# Altium schematic sheet [01] Cover_page.SchDoc: =GlobalProjectName
size A3; Engineer: M. Folejewski; DocumentNumber: 1; SheetNumber: 1; SheetTotal: 15; Designators: -; PageSize: A3
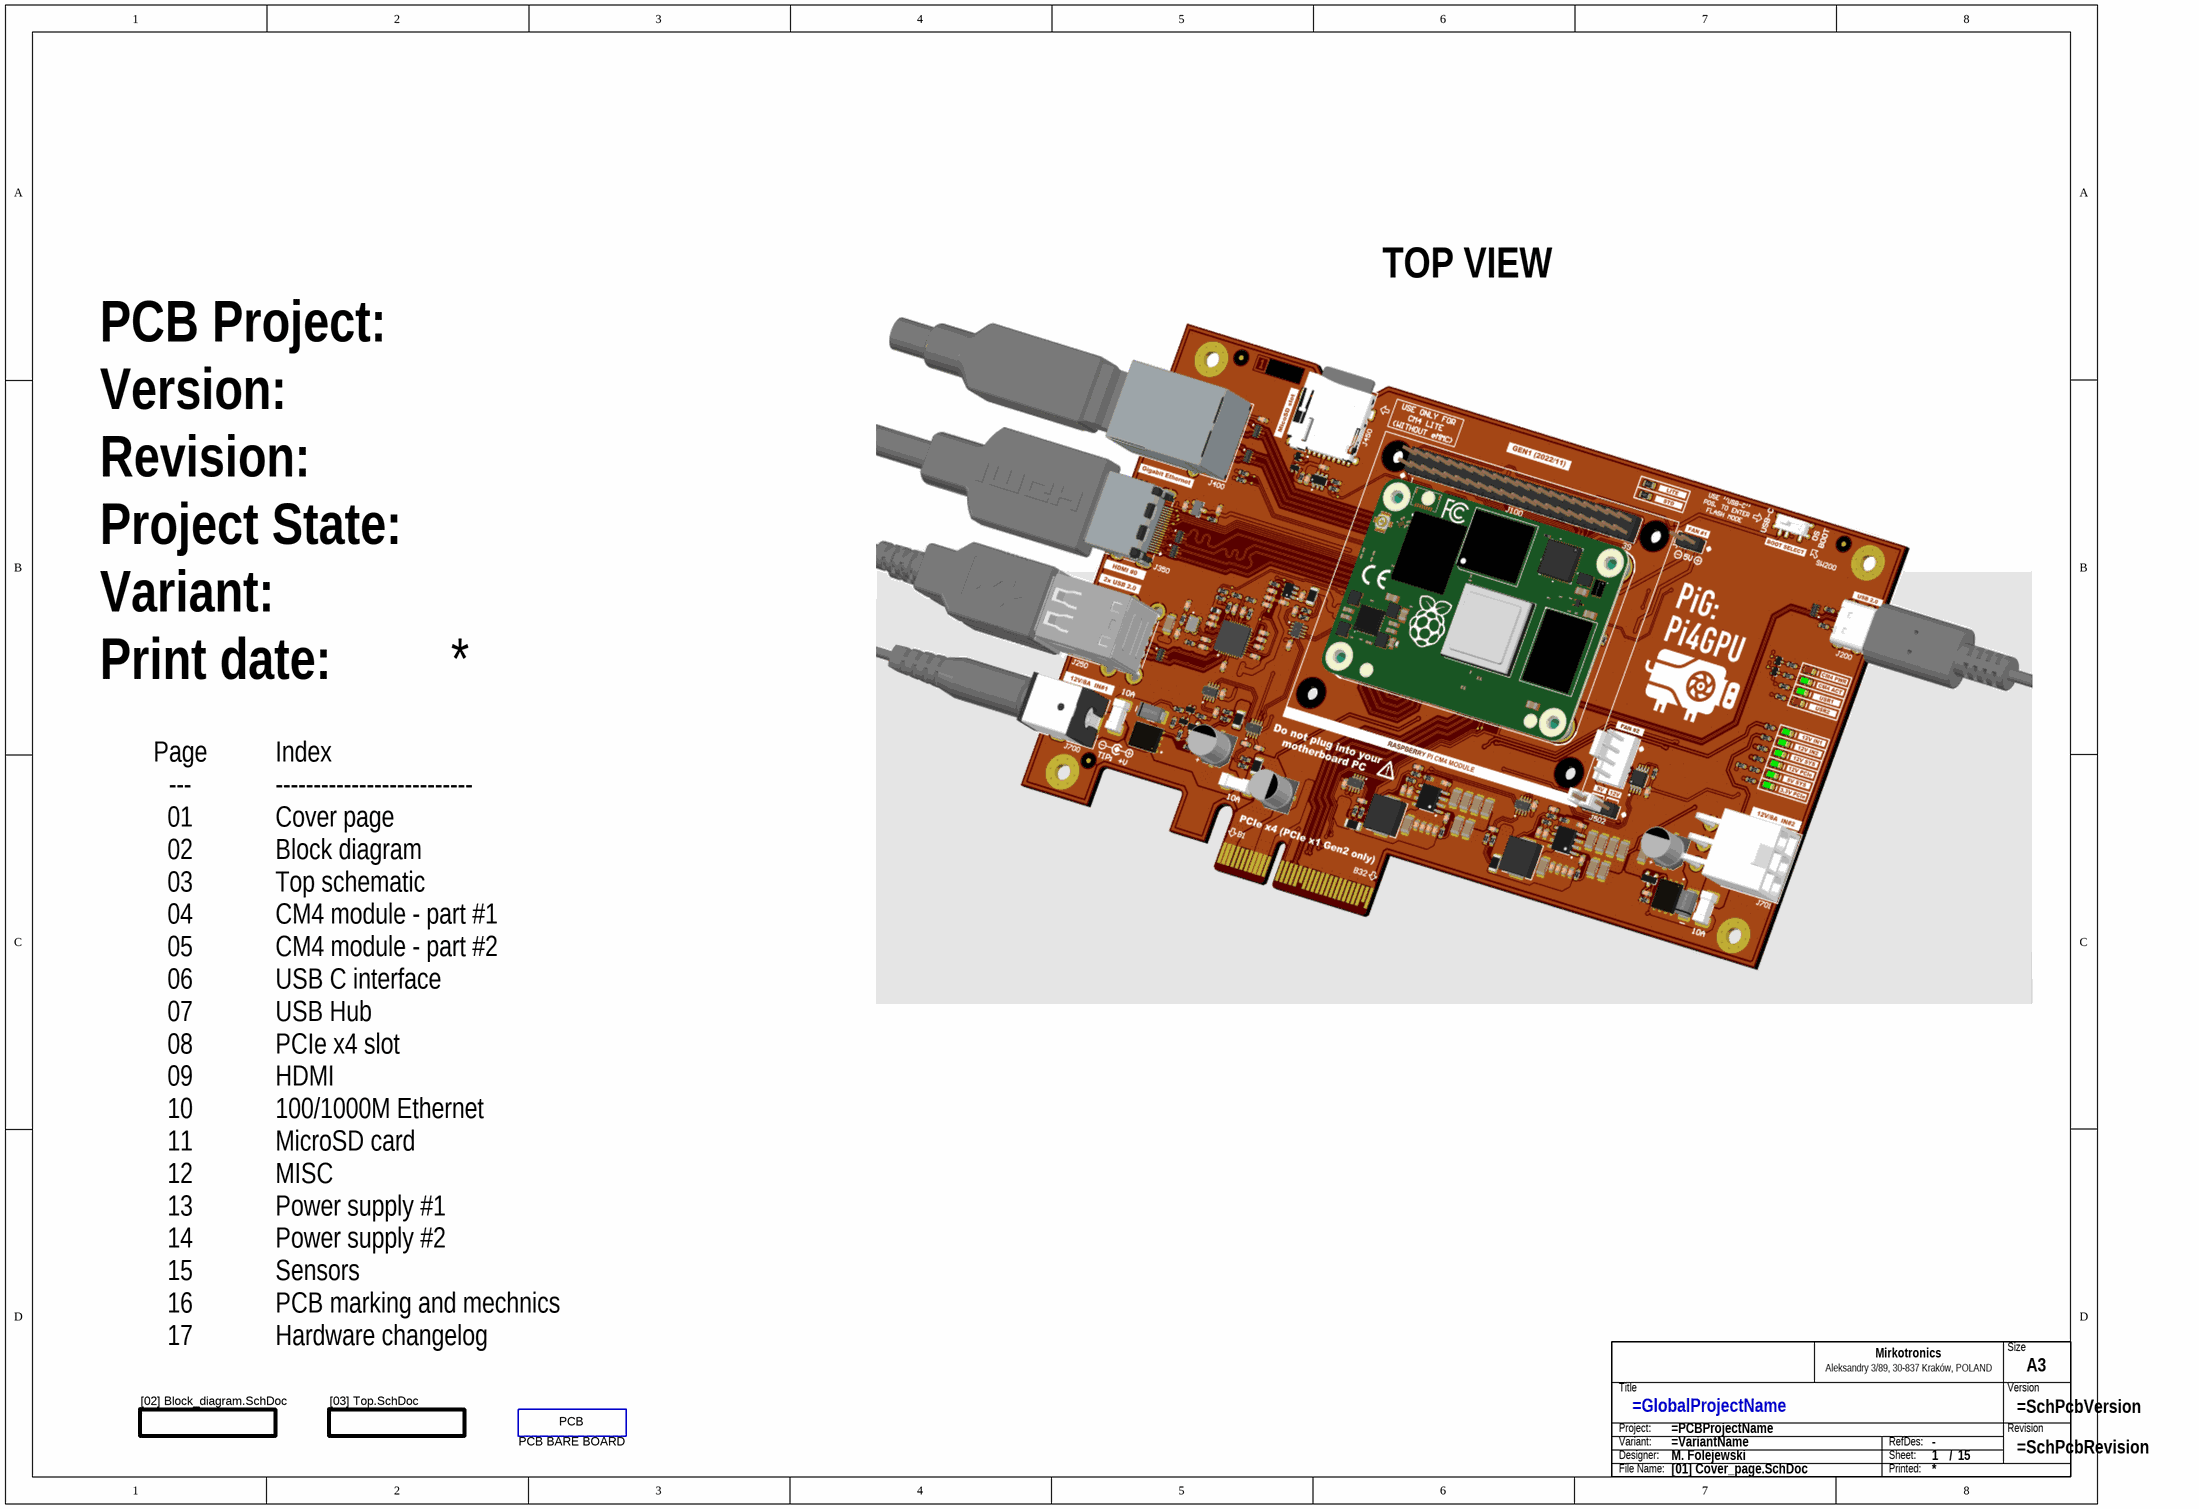
[diagram p0: [01] Cover_page.SchDoc]

## Parts
PCB1  PCB BARE BOARD  (mechanical)
TB?  Title block  (value not drawn)  (graphical)

## Sub-sheets
D8 = [02] Block_diagram.SchDoc: no entries
D9 = [03] Top.SchDoc: no entries

## Notes on the sheet
- TOP VIEW
- PCB Project:
- Version:
- Revision:
- Project State:
- Variant:
- Print date:
- Page
  ---
  01
  02
  03
  04
  05
  06
  07
  08
  09
  10
  11
  12
  13
  14
  15
  16
  17
- Index
  --------------------------
  Cover page
  Block diagram
  Top schematic
  CM4 module - part #1
  CM4 module - part #2
  USB C interface
  USB Hub
  PCIe x4 slot
  HDMI
  100/1000M Ethernet
  MicroSD card
  MISC
  Power supply #1
  Power supply #2
  Sensors
  PCB marking and mechnics
  Hardware changelog
- (in symbol PCB_BARE_BOARD) PCB
- (in symbol SCH_TITLE_BLOCK_MIRKOTRONICS_V2) Size; Mirkotronics; Aleksandry 3/89, 30-837 Kraków, POLAND; Title; Version; Project:; Revision; Variant:; RefDes:; Designer:; Sheet:; /; File Name:; Printed:

## Library data of the parts
PCB1 = PCB_BARE_BOARD: Component Subtype: PCB Board; Component Type: PCB board; Manufacturer: -; MPN: N/A; Value: PCB BARE BOARD; Mounting Type: -; Supplier: ?
TB? = SCH_TITLE_BLOCK_MIRKOTRONICS_V2: Component Type: Title block; Manufacturer: -; Mounting Type: Non component; MPN: -; Operating Temperature: -; Package: -; Specification: Title block; Value: Title block; Replacement: -; System: ?